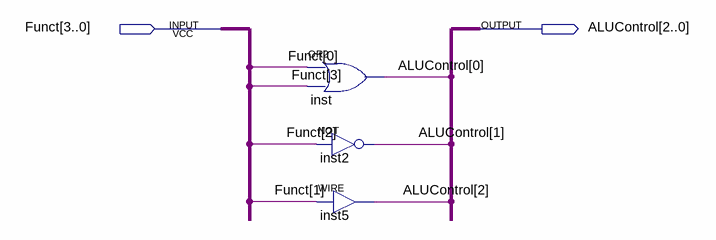
[diagram p0: schematic sheet]
// Quartus schematic aludcllayer.bdf as structural Verilog: 3 symbols, 2 pins
module aludcllayer (
  input  [3:0] Funct,
  output [2:0] ALUControl
);

  or inst (ALUControl[0], Funct[0], Funct[3]);
  not inst2 (ALUControl[1], Funct[2]);
  assign ALUControl[2] = Funct[1];  // WIRE inst5
endmodule
